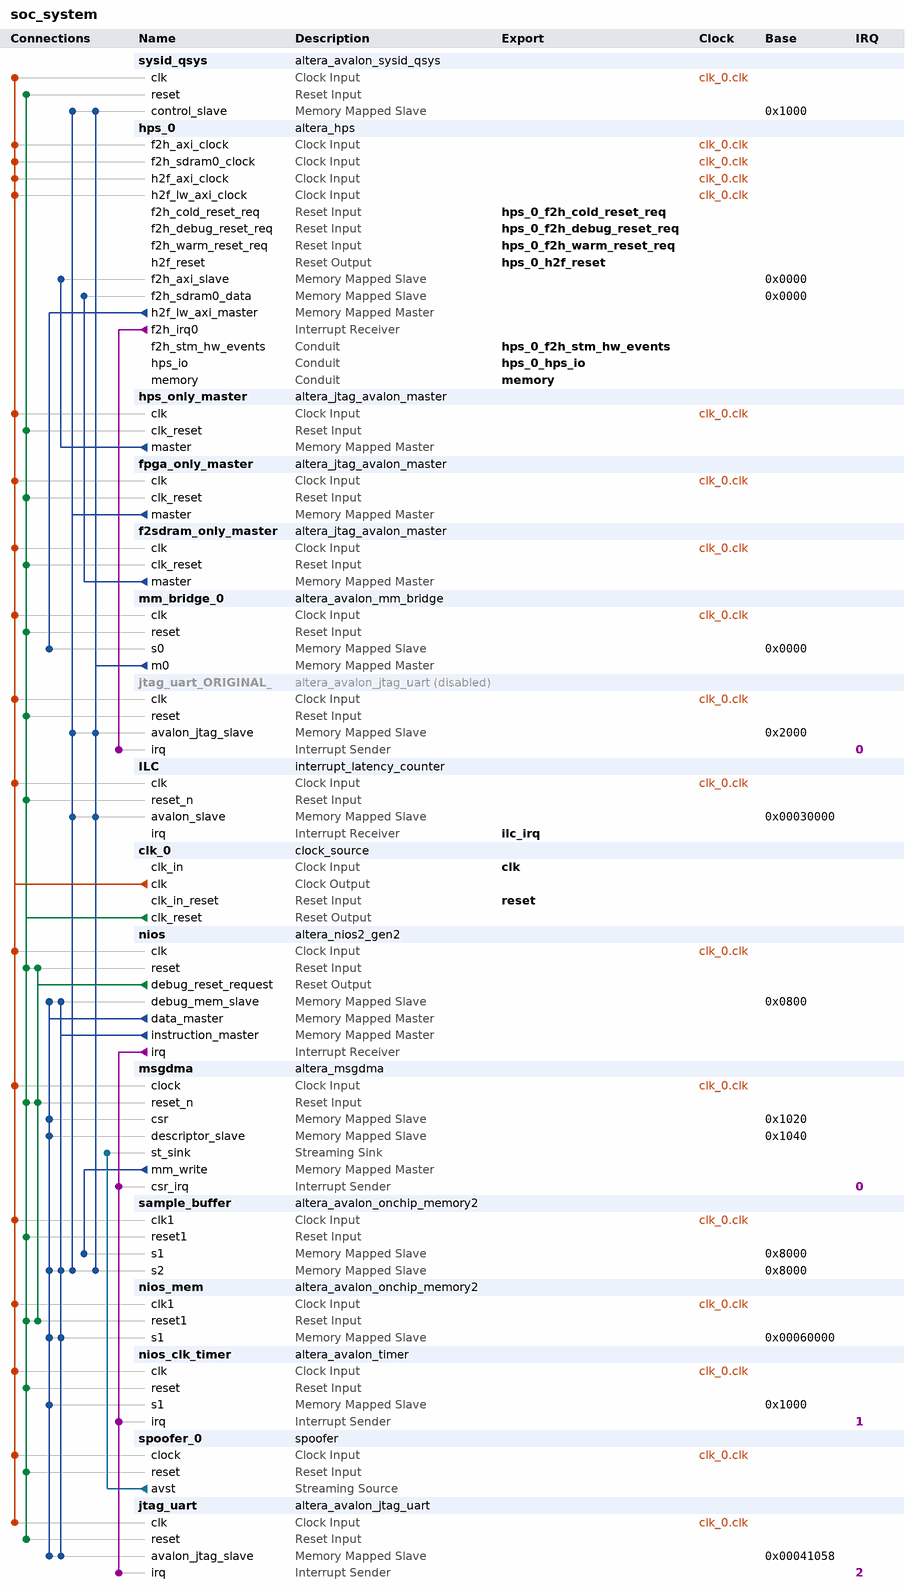
[diagram p0: system contents]
# Platform Designer (Qsys) system soc_system, Cyclone V 5CSEMA4U23C6
# Parameters at their usual value, and those the tool derives, are not listed.
package require -exact qsys 17.1
create_system soc_system
set_project_property DEVICE_FAMILY {Cyclone V}
set_project_property DEVICE 5CSEMA4U23C6

add_instance sysid_qsys altera_avalon_sysid_qsys 17.1
set_instance_parameter_value sysid_qsys id -1395322110

add_instance hps_0 altera_hps 17.1
set_instance_parameter_value hps_0 EMAC1_Mode RGMII
set_instance_parameter_value hps_0 EMAC1_PinMuxing {HPS I/O Set 0}
set_instance_parameter_value hps_0 F2SCLK_COLDRST_Enable true
set_instance_parameter_value hps_0 F2SCLK_DBGRST_Enable true
set_instance_parameter_value hps_0 F2SCLK_WARMRST_Enable true
set_instance_parameter_value hps_0 F2SDRAM_Type {Avalon-MM Bidirectional}
set_instance_parameter_value hps_0 F2SDRAM_Width 256
set_instance_parameter_value hps_0 F2SINTERRUPT_Enable true
set_instance_parameter_value hps_0 F2S_Width 2
set_instance_parameter_value hps_0 FPGA_PERIPHERAL_OUTPUT_CLOCK_FREQ_EMAC0_GTX_CLK 100
set_instance_parameter_value hps_0 FPGA_PERIPHERAL_OUTPUT_CLOCK_FREQ_EMAC0_MD_CLK 100.0
set_instance_parameter_value hps_0 FPGA_PERIPHERAL_OUTPUT_CLOCK_FREQ_EMAC1_GTX_CLK 100
set_instance_parameter_value hps_0 FPGA_PERIPHERAL_OUTPUT_CLOCK_FREQ_EMAC1_MD_CLK 100.0
set_instance_parameter_value hps_0 HPS_PROTOCOL DDR3
set_instance_parameter_value hps_0 I2C0_Mode I2C
set_instance_parameter_value hps_0 I2C0_PinMuxing {HPS I/O Set 0}
set_instance_parameter_value hps_0 I2C1_Mode I2C
set_instance_parameter_value hps_0 I2C1_PinMuxing {HPS I/O Set 0}
set_instance_parameter_value hps_0 LWH2F_Enable true
set_instance_parameter_value hps_0 MEM_BANKADDR_WIDTH 3
set_instance_parameter_value hps_0 MEM_CLK_FREQ 400.0
set_instance_parameter_value hps_0 MEM_COL_ADDR_WIDTH 10
set_instance_parameter_value hps_0 MEM_DQ_WIDTH 32
set_instance_parameter_value hps_0 MEM_DRV_STR RZQ/6
set_instance_parameter_value hps_0 MEM_ROW_ADDR_WIDTH 15
set_instance_parameter_value hps_0 MEM_RTT_NOM RZQ/6
set_instance_parameter_value hps_0 MEM_RTT_WR {Dynamic ODT off}
set_instance_parameter_value hps_0 MEM_TCL 7
set_instance_parameter_value hps_0 MEM_TFAW_NS 37.5
set_instance_parameter_value hps_0 MEM_TRAS_NS 35.0
set_instance_parameter_value hps_0 MEM_TRCD_NS 13.75
set_instance_parameter_value hps_0 MEM_TRFC_NS 300.0
set_instance_parameter_value hps_0 MEM_TRP_NS 13.75
set_instance_parameter_value hps_0 MEM_VENDOR Other
set_instance_parameter_value hps_0 MEM_WTCL 7
set_instance_parameter_value hps_0 QSPI_Mode N/A
set_instance_parameter_value hps_0 QSPI_PinMuxing Unused
set_instance_parameter_value hps_0 REF_CLK_FREQ 25.0
set_instance_parameter_value hps_0 S2FCLK_USER2CLK 4
set_instance_parameter_value hps_0 S2F_Width 2
set_instance_parameter_value hps_0 SDIO_Mode {4-bit Data}
set_instance_parameter_value hps_0 SDIO_PinMuxing {HPS I/O Set 0}
set_instance_parameter_value hps_0 SPIM1_Mode {Single Slave Select}
set_instance_parameter_value hps_0 SPIM1_PinMuxing {HPS I/O Set 0}
set_instance_parameter_value hps_0 STM_Enable true
set_instance_parameter_value hps_0 TIMING_BOARD_AC_SKEW 0.02
set_instance_parameter_value hps_0 TIMING_BOARD_AC_TO_CK_SKEW 0.0
set_instance_parameter_value hps_0 TIMING_BOARD_DQ_TO_DQS_SKEW 0.0
set_instance_parameter_value hps_0 TIMING_BOARD_MAX_CK_DELAY 0.6
set_instance_parameter_value hps_0 TIMING_BOARD_MAX_DQS_DELAY 0.6
set_instance_parameter_value hps_0 TIMING_BOARD_SKEW_BETWEEN_DQS 0.02
set_instance_parameter_value hps_0 TIMING_BOARD_SKEW_CKDQS_DIMM_MAX 0.01
set_instance_parameter_value hps_0 TIMING_BOARD_SKEW_CKDQS_DIMM_MIN -0.01
set_instance_parameter_value hps_0 TIMING_BOARD_SKEW_WITHIN_DQS 0.02
set_instance_parameter_value hps_0 TIMING_TDH 125
set_instance_parameter_value hps_0 TIMING_TDQSCK 400
set_instance_parameter_value hps_0 TIMING_TDQSQ 120
set_instance_parameter_value hps_0 TIMING_TDS 50
set_instance_parameter_value hps_0 TIMING_TIH 250
set_instance_parameter_value hps_0 TIMING_TIS 175
set_instance_parameter_value hps_0 TIMING_TQSH 0.38
set_instance_parameter_value hps_0 UART0_Mode {No Flow Control}
set_instance_parameter_value hps_0 UART0_PinMuxing {HPS I/O Set 0}
set_instance_parameter_value hps_0 USB1_Mode SDR
set_instance_parameter_value hps_0 USB1_PinMuxing {HPS I/O Set 0}
set_instance_parameter_value hps_0 desired_cfg_clk_mhz 100.0
set_instance_parameter_value hps_0 desired_qspi_clk_mhz 370.0

add_instance hps_only_master altera_jtag_avalon_master 17.1

add_instance fpga_only_master altera_jtag_avalon_master 17.1

add_instance f2sdram_only_master altera_jtag_avalon_master 17.1

add_instance mm_bridge_0 altera_avalon_mm_bridge 17.1
set_instance_parameter_value mm_bridge_0 ADDRESS_UNITS SYMBOLS
set_instance_parameter_value mm_bridge_0 ADDRESS_WIDTH 10
set_instance_parameter_value mm_bridge_0 DATA_WIDTH 32
set_instance_parameter_value mm_bridge_0 MAX_PENDING_RESPONSES 4
set_instance_parameter_value mm_bridge_0 USE_AUTO_ADDRESS_WIDTH 1

add_instance jtag_uart_ORIGINAL_ altera_avalon_jtag_uart 17.1
set_instance_property jtag_uart_ORIGINAL_ ENABLED false
set_instance_parameter_value jtag_uart_ORIGINAL_ allowMultipleConnections true
set_instance_parameter_value jtag_uart_ORIGINAL_ simInteractiveOptions INTERACTIVE_ASCII_OUTPUT

add_instance ILC interrupt_latency_counter 17.1

add_instance clk_0 clock_source 17.1
set_instance_parameter_value clk_0 clockFrequency 50000000

add_instance nios altera_nios2_gen2 17.1
set_instance_parameter_value nios dcache_size 2048
set_instance_parameter_value nios exceptionSlave nios_mem.s1
set_instance_parameter_value nios icache_size 4096
set_instance_parameter_value nios impl Tiny
set_instance_parameter_value nios resetSlave nios_mem.s1

add_instance msgdma altera_msgdma 17.1
set_instance_parameter_value msgdma BURST_ENABLE 0
set_instance_parameter_value msgdma DATA_FIFO_DEPTH 32
set_instance_parameter_value msgdma DATA_WIDTH 32
set_instance_parameter_value msgdma DESCRIPTOR_FIFO_DEPTH 128
set_instance_parameter_value msgdma ENHANCED_FEATURES 0
set_instance_parameter_value msgdma ERROR_ENABLE 0
set_instance_parameter_value msgdma MAX_BURST_COUNT 2
set_instance_parameter_value msgdma MAX_BYTE 1024
set_instance_parameter_value msgdma MODE 2
set_instance_parameter_value msgdma PACKET_ENABLE 0
set_instance_parameter_value msgdma TRANSFER_TYPE {Aligned Accesses}

add_instance sample_buffer altera_avalon_onchip_memory2 17.1
set_instance_parameter_value sample_buffer dataWidth 32
set_instance_parameter_value sample_buffer dualPort true
set_instance_parameter_value sample_buffer initMemContent true
set_instance_parameter_value sample_buffer initializationFileName onchip_mem.hex
set_instance_parameter_value sample_buffer memorySize 20480
set_instance_parameter_value sample_buffer readDuringWriteMode OLD_DATA
set_instance_parameter_value sample_buffer singleClockOperation true

add_instance nios_mem altera_avalon_onchip_memory2 17.1
set_instance_parameter_value nios_mem dataWidth 32
set_instance_parameter_value nios_mem dualPort false
set_instance_parameter_value nios_mem initMemContent true
set_instance_parameter_value nios_mem initializationFileName onchip_mem.hex
set_instance_parameter_value nios_mem memorySize 102400

add_instance nios_clk_timer altera_avalon_timer 17.1
set_instance_parameter_value nios_clk_timer period 1
set_instance_parameter_value nios_clk_timer periodUnits MSEC

add_instance spoofer_0 spoofer 1.0
set_instance_parameter_value spoofer_0 DATA_WIDTH 32

add_instance jtag_uart altera_avalon_jtag_uart 17.1
set_instance_parameter_value jtag_uart allowMultipleConnections true
set_instance_parameter_value jtag_uart simInteractiveOptions INTERACTIVE_ASCII_OUTPUT

# connections
add_connection clk_0.clk f2sdram_only_master.clk clock
add_connection clk_0.clk fpga_only_master.clk clock
add_connection clk_0.clk hps_0.f2h_axi_clock clock
add_connection clk_0.clk hps_0.f2h_sdram0_clock clock
add_connection clk_0.clk hps_0.h2f_axi_clock clock
add_connection clk_0.clk hps_0.h2f_lw_axi_clock clock
add_connection clk_0.clk hps_only_master.clk clock
add_connection clk_0.clk ILC.clk clock
add_connection clk_0.clk jtag_uart.clk clock
add_connection clk_0.clk jtag_uart_ORIGINAL_.clk clock
add_connection clk_0.clk mm_bridge_0.clk clock
add_connection clk_0.clk msgdma.clock clock
add_connection clk_0.clk nios.clk clock
add_connection clk_0.clk nios_clk_timer.clk clock
add_connection clk_0.clk nios_mem.clk1 clock
add_connection clk_0.clk sample_buffer.clk1 clock
add_connection clk_0.clk spoofer_0.clock clock
add_connection clk_0.clk sysid_qsys.clk clock
add_connection clk_0.clk_reset f2sdram_only_master.clk_reset reset
add_connection clk_0.clk_reset fpga_only_master.clk_reset reset
add_connection clk_0.clk_reset hps_only_master.clk_reset reset
add_connection clk_0.clk_reset ILC.reset_n reset
add_connection clk_0.clk_reset jtag_uart.reset reset
add_connection clk_0.clk_reset jtag_uart_ORIGINAL_.reset reset
add_connection clk_0.clk_reset mm_bridge_0.reset reset
add_connection clk_0.clk_reset msgdma.reset_n reset
add_connection clk_0.clk_reset nios.reset reset
add_connection clk_0.clk_reset nios_clk_timer.reset reset
add_connection clk_0.clk_reset nios_mem.reset1 reset
add_connection clk_0.clk_reset sample_buffer.reset1 reset
add_connection clk_0.clk_reset spoofer_0.reset reset
add_connection clk_0.clk_reset sysid_qsys.reset reset
add_connection nios.debug_reset_request msgdma.reset_n reset
add_connection nios.debug_reset_request nios.reset reset
add_connection nios.debug_reset_request nios_mem.reset1 reset
add_connection f2sdram_only_master.master hps_0.f2h_sdram0_data avalon
set_connection_parameter_value f2sdram_only_master.master/hps_0.f2h_sdram0_data baseAddress 0x0000
add_connection fpga_only_master.master ILC.avalon_slave avalon
set_connection_parameter_value fpga_only_master.master/ILC.avalon_slave baseAddress 0x00030000
add_connection fpga_only_master.master jtag_uart_ORIGINAL_.avalon_jtag_slave avalon
set_connection_parameter_value fpga_only_master.master/jtag_uart_ORIGINAL_.avalon_jtag_slave baseAddress 0x2000
add_connection fpga_only_master.master sample_buffer.s2 avalon
set_connection_parameter_value fpga_only_master.master/sample_buffer.s2 baseAddress 0x8000
add_connection fpga_only_master.master sysid_qsys.control_slave avalon
set_connection_parameter_value fpga_only_master.master/sysid_qsys.control_slave baseAddress 0x1000
add_connection hps_0.h2f_lw_axi_master mm_bridge_0.s0 avalon
set_connection_parameter_value hps_0.h2f_lw_axi_master/mm_bridge_0.s0 baseAddress 0x0000
add_connection hps_only_master.master hps_0.f2h_axi_slave avalon
set_connection_parameter_value hps_only_master.master/hps_0.f2h_axi_slave baseAddress 0x0000
add_connection mm_bridge_0.m0 ILC.avalon_slave avalon
set_connection_parameter_value mm_bridge_0.m0/ILC.avalon_slave baseAddress 0x00030000
add_connection mm_bridge_0.m0 jtag_uart_ORIGINAL_.avalon_jtag_slave avalon
set_connection_parameter_value mm_bridge_0.m0/jtag_uart_ORIGINAL_.avalon_jtag_slave baseAddress 0x2000
add_connection mm_bridge_0.m0 sample_buffer.s2 avalon
set_connection_parameter_value mm_bridge_0.m0/sample_buffer.s2 baseAddress 0x8000
add_connection mm_bridge_0.m0 sysid_qsys.control_slave avalon
set_connection_parameter_value mm_bridge_0.m0/sysid_qsys.control_slave baseAddress 0x1000
add_connection msgdma.mm_write sample_buffer.s1 avalon
set_connection_parameter_value msgdma.mm_write/sample_buffer.s1 baseAddress 0x8000
add_connection nios.data_master jtag_uart.avalon_jtag_slave avalon
set_connection_parameter_value nios.data_master/jtag_uart.avalon_jtag_slave baseAddress 0x00041058
add_connection nios.data_master msgdma.csr avalon
set_connection_parameter_value nios.data_master/msgdma.csr baseAddress 0x1020
add_connection nios.data_master msgdma.descriptor_slave avalon
set_connection_parameter_value nios.data_master/msgdma.descriptor_slave baseAddress 0x1040
add_connection nios.data_master nios.debug_mem_slave avalon
set_connection_parameter_value nios.data_master/nios.debug_mem_slave baseAddress 0x0800
add_connection nios.data_master nios_clk_timer.s1 avalon
set_connection_parameter_value nios.data_master/nios_clk_timer.s1 baseAddress 0x1000
add_connection nios.data_master nios_mem.s1 avalon
set_connection_parameter_value nios.data_master/nios_mem.s1 baseAddress 0x00060000
add_connection nios.data_master sample_buffer.s2 avalon
set_connection_parameter_value nios.data_master/sample_buffer.s2 baseAddress 0x8000
add_connection nios.instruction_master jtag_uart.avalon_jtag_slave avalon
set_connection_parameter_value nios.instruction_master/jtag_uart.avalon_jtag_slave baseAddress 0x00041058
add_connection nios.instruction_master nios.debug_mem_slave avalon
set_connection_parameter_value nios.instruction_master/nios.debug_mem_slave baseAddress 0x0800
add_connection nios.instruction_master nios_mem.s1 avalon
set_connection_parameter_value nios.instruction_master/nios_mem.s1 baseAddress 0x00060000
add_connection nios.instruction_master sample_buffer.s2 avalon
set_connection_parameter_value nios.instruction_master/sample_buffer.s2 baseAddress 0x8000
add_connection spoofer_0.avst msgdma.st_sink avalon_streaming
add_connection hps_0.f2h_irq0 jtag_uart_ORIGINAL_.irq interrupt
set_connection_parameter_value hps_0.f2h_irq0/jtag_uart_ORIGINAL_.irq irqNumber 0
add_connection nios.irq jtag_uart.irq interrupt
set_connection_parameter_value nios.irq/jtag_uart.irq irqNumber 2
add_connection nios.irq msgdma.csr_irq interrupt
set_connection_parameter_value nios.irq/msgdma.csr_irq irqNumber 0
add_connection nios.irq nios_clk_timer.irq interrupt
set_connection_parameter_value nios.irq/nios_clk_timer.irq irqNumber 1

# exported interfaces
add_interface clk clock sink
set_interface_property clk EXPORT_OF clk_0.clk_in
add_interface hps_0_f2h_cold_reset_req reset sink
set_interface_property hps_0_f2h_cold_reset_req EXPORT_OF hps_0.f2h_cold_reset_req
add_interface hps_0_f2h_debug_reset_req reset sink
set_interface_property hps_0_f2h_debug_reset_req EXPORT_OF hps_0.f2h_debug_reset_req
add_interface hps_0_f2h_stm_hw_events conduit end
set_interface_property hps_0_f2h_stm_hw_events EXPORT_OF hps_0.f2h_stm_hw_events
add_interface hps_0_f2h_warm_reset_req reset sink
set_interface_property hps_0_f2h_warm_reset_req EXPORT_OF hps_0.f2h_warm_reset_req
add_interface hps_0_h2f_reset reset source
set_interface_property hps_0_h2f_reset EXPORT_OF hps_0.h2f_reset
add_interface hps_0_hps_io conduit end
set_interface_property hps_0_hps_io EXPORT_OF hps_0.hps_io
add_interface ilc_irq interrupt receiver
set_interface_property ilc_irq EXPORT_OF ILC.irq
add_interface memory conduit end
set_interface_property memory EXPORT_OF hps_0.memory
add_interface reset reset sink
set_interface_property reset EXPORT_OF clk_0.clk_in_reset

set_interconnect_requirement {$system} qsys_mm.clockCrossingAdapter HANDSHAKE
set_interconnect_requirement {$system} qsys_mm.maxAdditionalLatency 1

save_system soc_system.qsys
